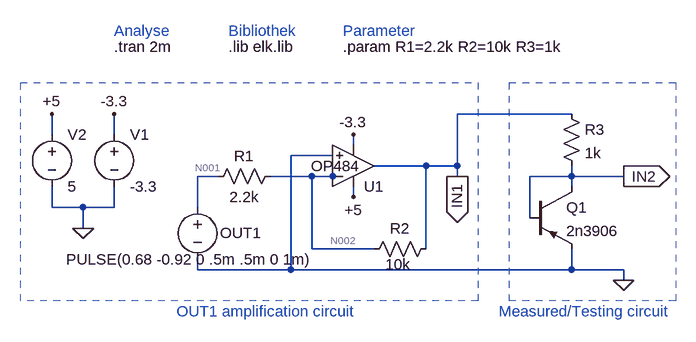
[diagram p0: schematic Draft_pnp-Transistor_als_Diode.asc]
Draft_pnp-Transistor_als_Diode.asc, the LTspice schematic file:
Version 4
SHEET 1 880 680
WIRE 512 48 336 48
WIRE -288 80 -288 48
WIRE -192 80 -192 48
WIRE 176 96 176 80
WIRE 144 112 80 112
WIRE 288 128 208 128
WIRE 336 128 336 48
WIRE 336 128 288 128
WIRE -32 144 -64 144
WIRE 112 144 48 144
WIRE 144 144 112 144
WIRE 336 144 336 128
WIRE 512 144 512 128
WIRE 512 144 448 144
WIRE 592 144 512 144
WIRE 144 160 144 144
WIRE 512 160 512 144
WIRE 176 176 176 160
WIRE -288 192 -288 160
WIRE -240 192 -288 192
WIRE -192 192 -192 160
WIRE -192 192 -240 192
WIRE -64 192 -64 144
WIRE 448 208 448 144
WIRE -240 224 -240 192
WIRE 112 256 112 144
WIRE 208 256 112 256
WIRE 288 256 288 128
WIRE -64 288 -64 272
WIRE 80 288 80 112
WIRE 80 288 -64 288
WIRE 512 288 512 256
WIRE 512 288 80 288
WIRE 592 288 512 288
WIRE 592 304 592 288
FLAG 592 304 0
FLAG 176 176 +5
FLAG 176 80 -3.3
FLAG -240 224 0
FLAG -192 48 -3.3
FLAG -288 48 +5
FLAG 336 144 IN1
IOPIN 336 144 Out
FLAG 592 144 IN2
IOPIN 592 144 Out
SYMBOL Opamps\\opamp2 176 192 M180
WINDOW 3 -65 64 Left 2
SYMATTR Value OP484
SYMATTR InstName U1
SYMBOL res 304 240 R90
WINDOW 0 0 56 VBottom 2
WINDOW 3 24 59 VTop 2
SYMATTR InstName R2
SYMATTR Value 10k
SYMBOL res 496 32 R0
SYMATTR InstName R3
SYMATTR Value 1k
SYMBOL voltage -192 64 R0
WINDOW 123 0 0 Left 0
WINDOW 39 0 0 Left 0
SYMATTR InstName V1
SYMATTR Value -3.3
SYMBOL voltage -288 64 R0
WINDOW 123 0 0 Left 0
WINDOW 39 0 0 Left 0
SYMATTR InstName V2
SYMATTR Value 5
SYMBOL voltage -64 176 R0
WINDOW 3 -202 96 Left 2
WINDOW 123 0 0 Left 0
WINDOW 39 0 0 Left 0
WINDOW 0 35 55 Left 2
SYMATTR Value PULSE(0.68 -0.92 0 .5m .5m 0 1m)
SYMATTR InstName OUT1
SYMBOL res 64 128 R90
WINDOW 0 0 56 VBottom 2
WINDOW 3 32 56 VTop 2
SYMATTR InstName R1
SYMATTR Value 2.2k
SYMBOL pnp 448 160 R0
SYMATTR InstName Q1
SYMATTR Value 2n3906
TEXT -96 352 Left 2 ;OUT1 amplification circuit
TEXT 400 352 Left 2 ;Measured/Testing circuit
TEXT -192 -56 Left 2 !.tran 2m
TEXT -16 -56 Left 2 !.lib elk.lib
TEXT 160 -56 Left 2 !.param R1=2.2k R2=10k R3=1k
TEXT -192 -80 Left 2 ;Analyse
TEXT -16 -80 Left 2 ;Bibliothek
TEXT 160 -80 Left 2 ;Parameter
RECTANGLE Normal 368 336 -336 0 1
RECTANGLE Normal 672 336 416 0 1

The netlist it stands for:
* Draft_pnp-Transistor_als_Diode.asc
XU1 0 N002 +5 -3.3 IN1 OP484  ; pins In+ In- V+ V- OUT
R2 IN1 N002 10k
R3 IN1 IN2 1k
V1 -3.3 0 -3.3
V2 +5 0 5
V§OUT1 N001 0 PULSE(0.68 -0.92 0 .5m .5m 0 1m)
R1 N002 N001 2.2k
Q1 IN2 IN2 0 0 2n3906
.model NPN NPN
.model PNP PNP
.lib standard.bjt
* OUT1 amplification circuit
* Measured/Testing circuit
.tran 2m
.lib elk.lib
.param R1=2.2k R2=10k R3=1k
* Analyse
* Bibliothek
* Parameter
.backanno
.end

* Results of the author's LTspice run, read from the files saved beside the schematic
* Operating Point, zero values left out:
*   V(n002) = 374.4 µV
*   V(+5) = 5 V
*   V(-3.3) = -3.3 V
*   V(in1) = -3.09 V
*   V(in2) = -678.4 mV
*   V(n001) = 680 mV
*   Ic(Q1) = -2.399 mA
*   Ib(Q1) = -12.07 µA
*   Ie(Q1) = 2.411 mA
*   I(R1) = -308.9 µA
*   I(R3) = -2.411 mA
*   I(R2) = -309 µA
*   I(Out1) = -308.9 µA
*   I(V2) = -734.5 µA
*   I(V1) = 3.454 mA
*   Ix(u1:1) = -75.22 nA
*   Ix(u1:2) = -66.78 nA
*   Ix(u1:99) = 734.5 µA
*   Ix(u1:50) = -3.454 mA
*   Ix(u1:45) = 2.72 mA
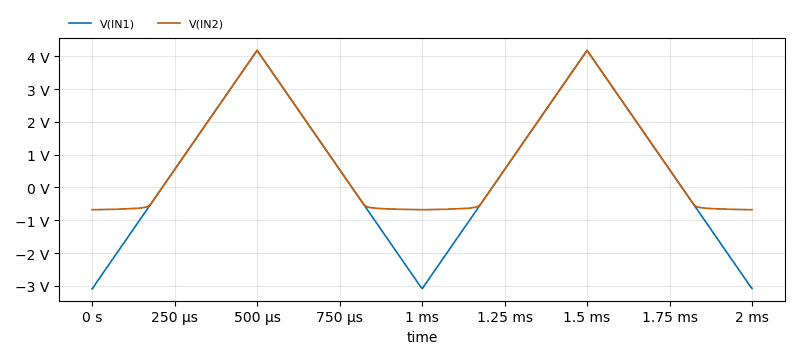
[diagram p1: Transient Analysis of Draft_pnp-Transistor_als_Diode.asc, plotted from the saved traces]
* Transient Analysis, 1 run:
*   V(IN1): min -3.09 V, max 4.181 V, average 545.1 mV, rms 2.202 V, last -3.078 V
*   V(IN2): min -678.4 mV, max 4.181 V, average 954.2 mV, rms 1.905 V, last -678.3 mV